# Altium schematic sheet test1.SchDoc
size A3; Organization: Altium Limited; Address1: L3, 12a Rodborough Rd; Address2: Frenchs Forest; Address3: NSW; Address4: Australia 2086
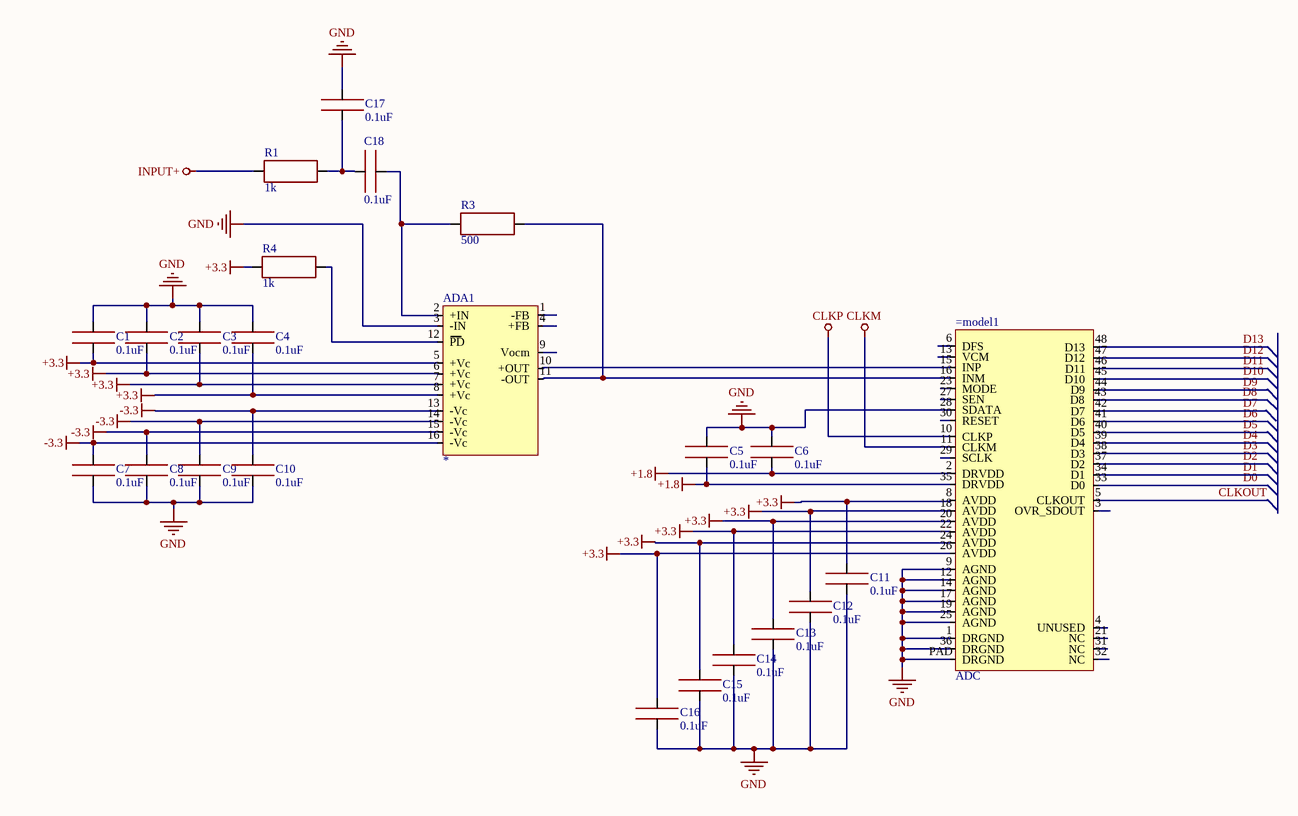
[diagram p0: test1.SchDoc]

## Parts
=model1  ADC  [PCBComponent_1 - duplicate2]
ADA1  *  [PCBComponent_1 - duplicate1]
C1  0.1uF  [PCBComponent_1 - duplicate]
C2  0.1uF  [PCBComponent_1 - duplicate]
C3  0.1uF  [PCBComponent_1 - duplicate]
C4  0.1uF  [PCBComponent_1 - duplicate]
C5  0.1uF  [PCBComponent_1 - duplicate]
C6  0.1uF  [PCBComponent_1 - duplicate]
C7  0.1uF  [PCBComponent_1 - duplicate]
C8  0.1uF  [PCBComponent_1 - duplicate]
C9  0.1uF  [PCBComponent_1 - duplicate]
C10  0.1uF  [PCBComponent_1 - duplicate]
C11  0.1uF  [PCBComponent_1 - duplicate]
C12  0.1uF  [PCBComponent_1 - duplicate]
C13  0.1uF  [PCBComponent_1 - duplicate]
C14  0.1uF  [PCBComponent_1 - duplicate]
C15  0.1uF  [PCBComponent_1 - duplicate]
C16  0.1uF  [PCBComponent_1 - duplicate]
C17  0.1uF  [PCBComponent_1 - duplicate]
C18  0.1uF  [PCBComponent_1 - duplicate]
R1  1k  [PCBComponent_1]
R3  500  [PCBComponent_1]
R4  1k  [PCBComponent_1]

## Nets
+1.8: =model1.2(DRVDD) =model1.35(DRVDD) C5.1 C6.0
+3.3: =model1.8(AVDD) =model1.18(AVDD) =model1.20(AVDD) =model1.22(AVDD) =model1.24(AVDD) =model1.26(AVDD) ADA1.5(+Vc) ADA1.6(+Vc) ADA1.7(+Vc) ADA1.8(+Vc) C1.0 C2.0 C3.0 C4.0 C11.1 C12.0 C13.1 C14.1 C15.0 C16.1 R4.1
-3.3: ADA1.13(-Vc) ADA1.14(-Vc) ADA1.15(-Vc) ADA1.16(-Vc) C7.1 C8.1 C9.1 C10.1
CLKM: =model1.11(CLKM)
CLKP: =model1.10(CLKP)
GND: =model1.1(DRGND) =model1.9(AGND) =model1.12(AGND) =model1.14(AGND) =model1.17(AGND) =model1.19(AGND) =model1.25(AGND) =model1.28(SDATA) =model1.36(DRGND) =model1.PAD(DRGND) ADA1.3(-IN) C1.1 C2.1 C3.1 C4.1 C5.0 C6.1 C7.0 C8.0 C9.0 C10.0 C11.0 C12.1 C13.0 C14.0 C15.1 C16.0 C17.1
INPUT+: R1.1
CLKOUT: =model1.5(CLKOUT)
D0: =model1.33(D0)
D1: =model1.34(D1)
D2: =model1.37(D2)
D3: =model1.38(D3)
D4: =model1.39(D4)
D5: =model1.40(D5)
D6: =model1.41(D6)
D7: =model1.42(D7)
D8: =model1.43(D8)
D9: =model1.44(D9)
D10: =model1.45(D10)
D11: =model1.46(D11)
D12: =model1.47(D12)
D13: =model1.48(D13)
Net=model1_15: =model1.15(INP) ADA1.10(+OUT)
Net=model1_16: =model1.16(INM) ADA1.11(-OUT) R3.1
NetADA1_2: ADA1.2(+IN) C18.1 R3.0
NetADA1_12: ADA1.12(PD) R4.0
NetC17_0: C17.0 C18.0 R1.0

Not connected (* = marked no-connect by the designer): =model1 3(OVR_SDOUT) 4(UNUSED) 6(DFS) 13(VCM) 21(NC) 23(MODE) 27(SEN) 29(SCLK) 30(RESET) 31(NC) 32(NC); ADA1 1(-FB) 4(+FB) 9(Vocm)

## Notes on the sheet
- Title
- Size:
- Date:
- A3
- Number:
- Time:
- Revision:
- Sheet
- of
- File:

## Library data of the parts
ADA1 = operational amplifier: model: *; manufactor: *
C1-C18 = Capasitor_1: manufactor: *; value: 0.1uF; model: *
R1 R3 R4 = resistor_1: model: *; manufactor: *
  R1 R4: value: 1k
  R3: value: 500
=model1 = ADC: model: *; manufactor: *